# Altium schematic sheet 0262_GPU VCCGT IMVP8 VR.SchDoc
size 848 x 558 mm
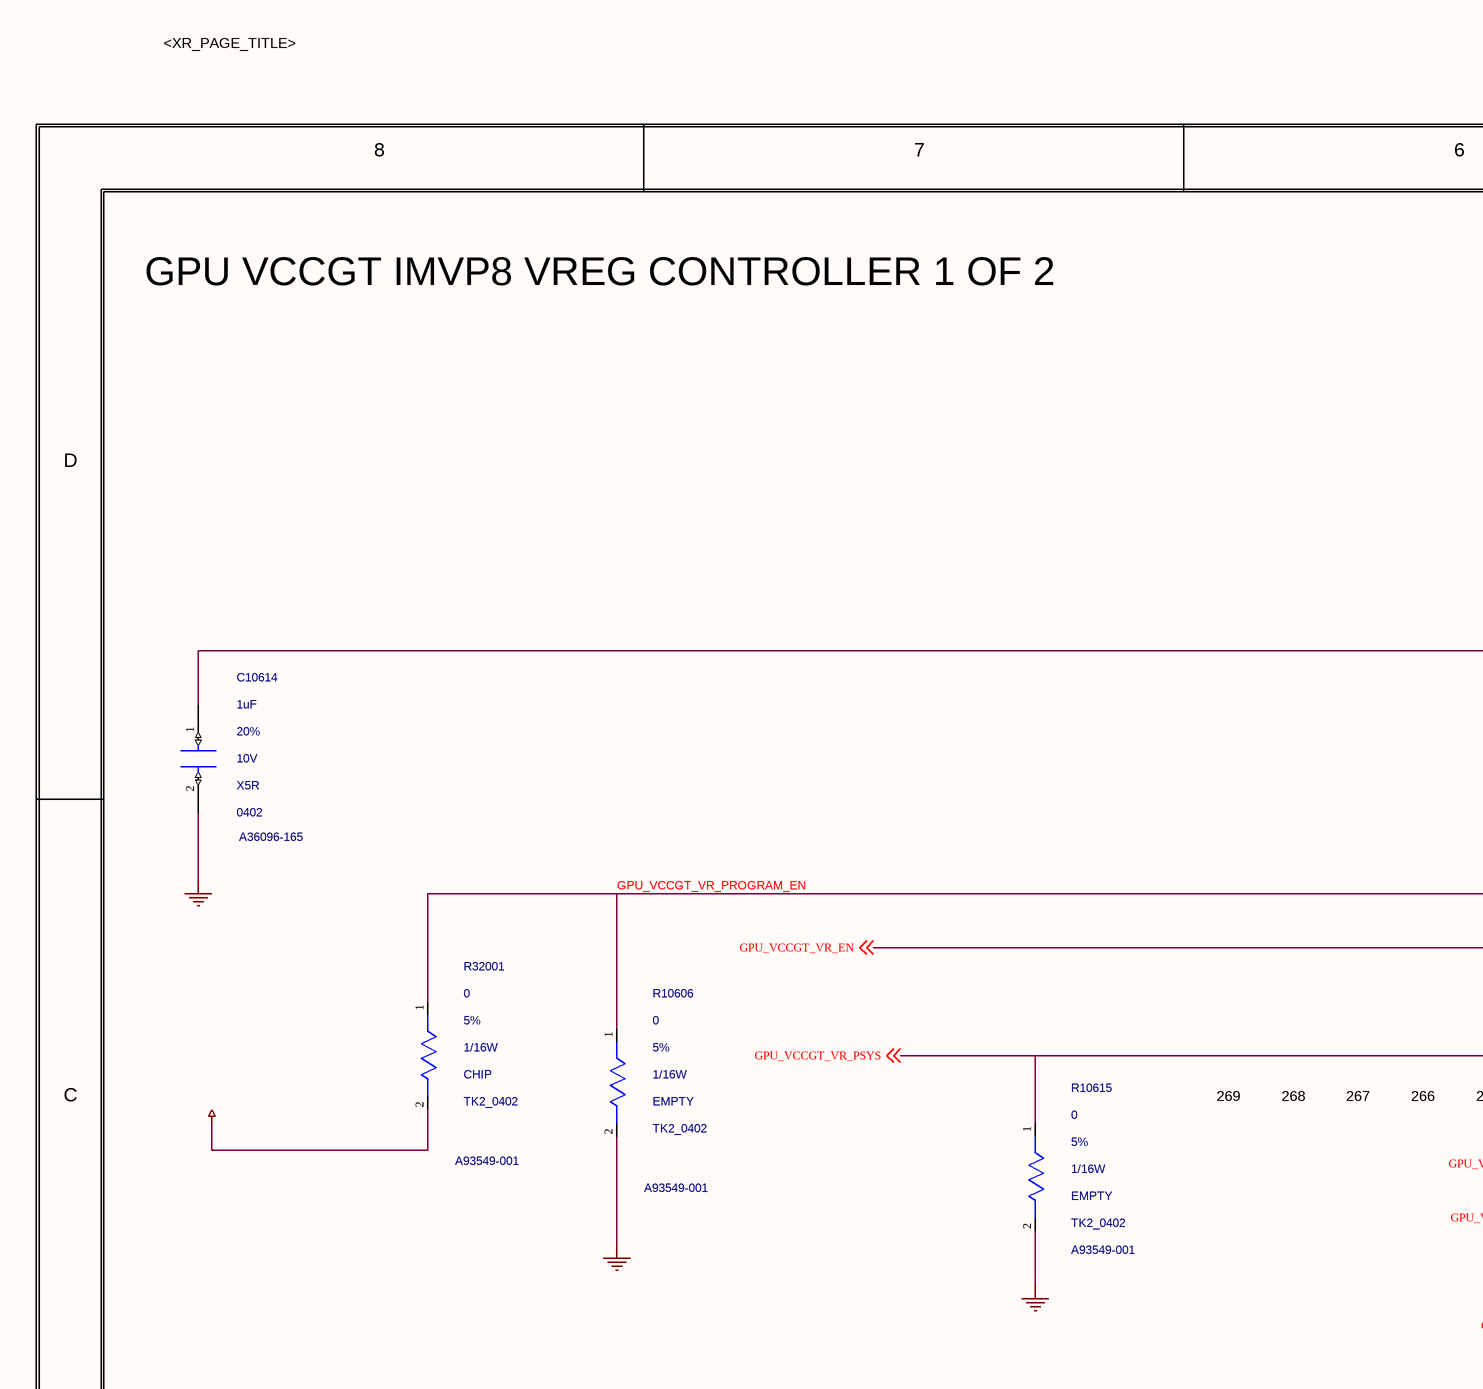
[diagram p0: 0262_GPU VCCGT IMVP8 VR.SchDoc, top left]
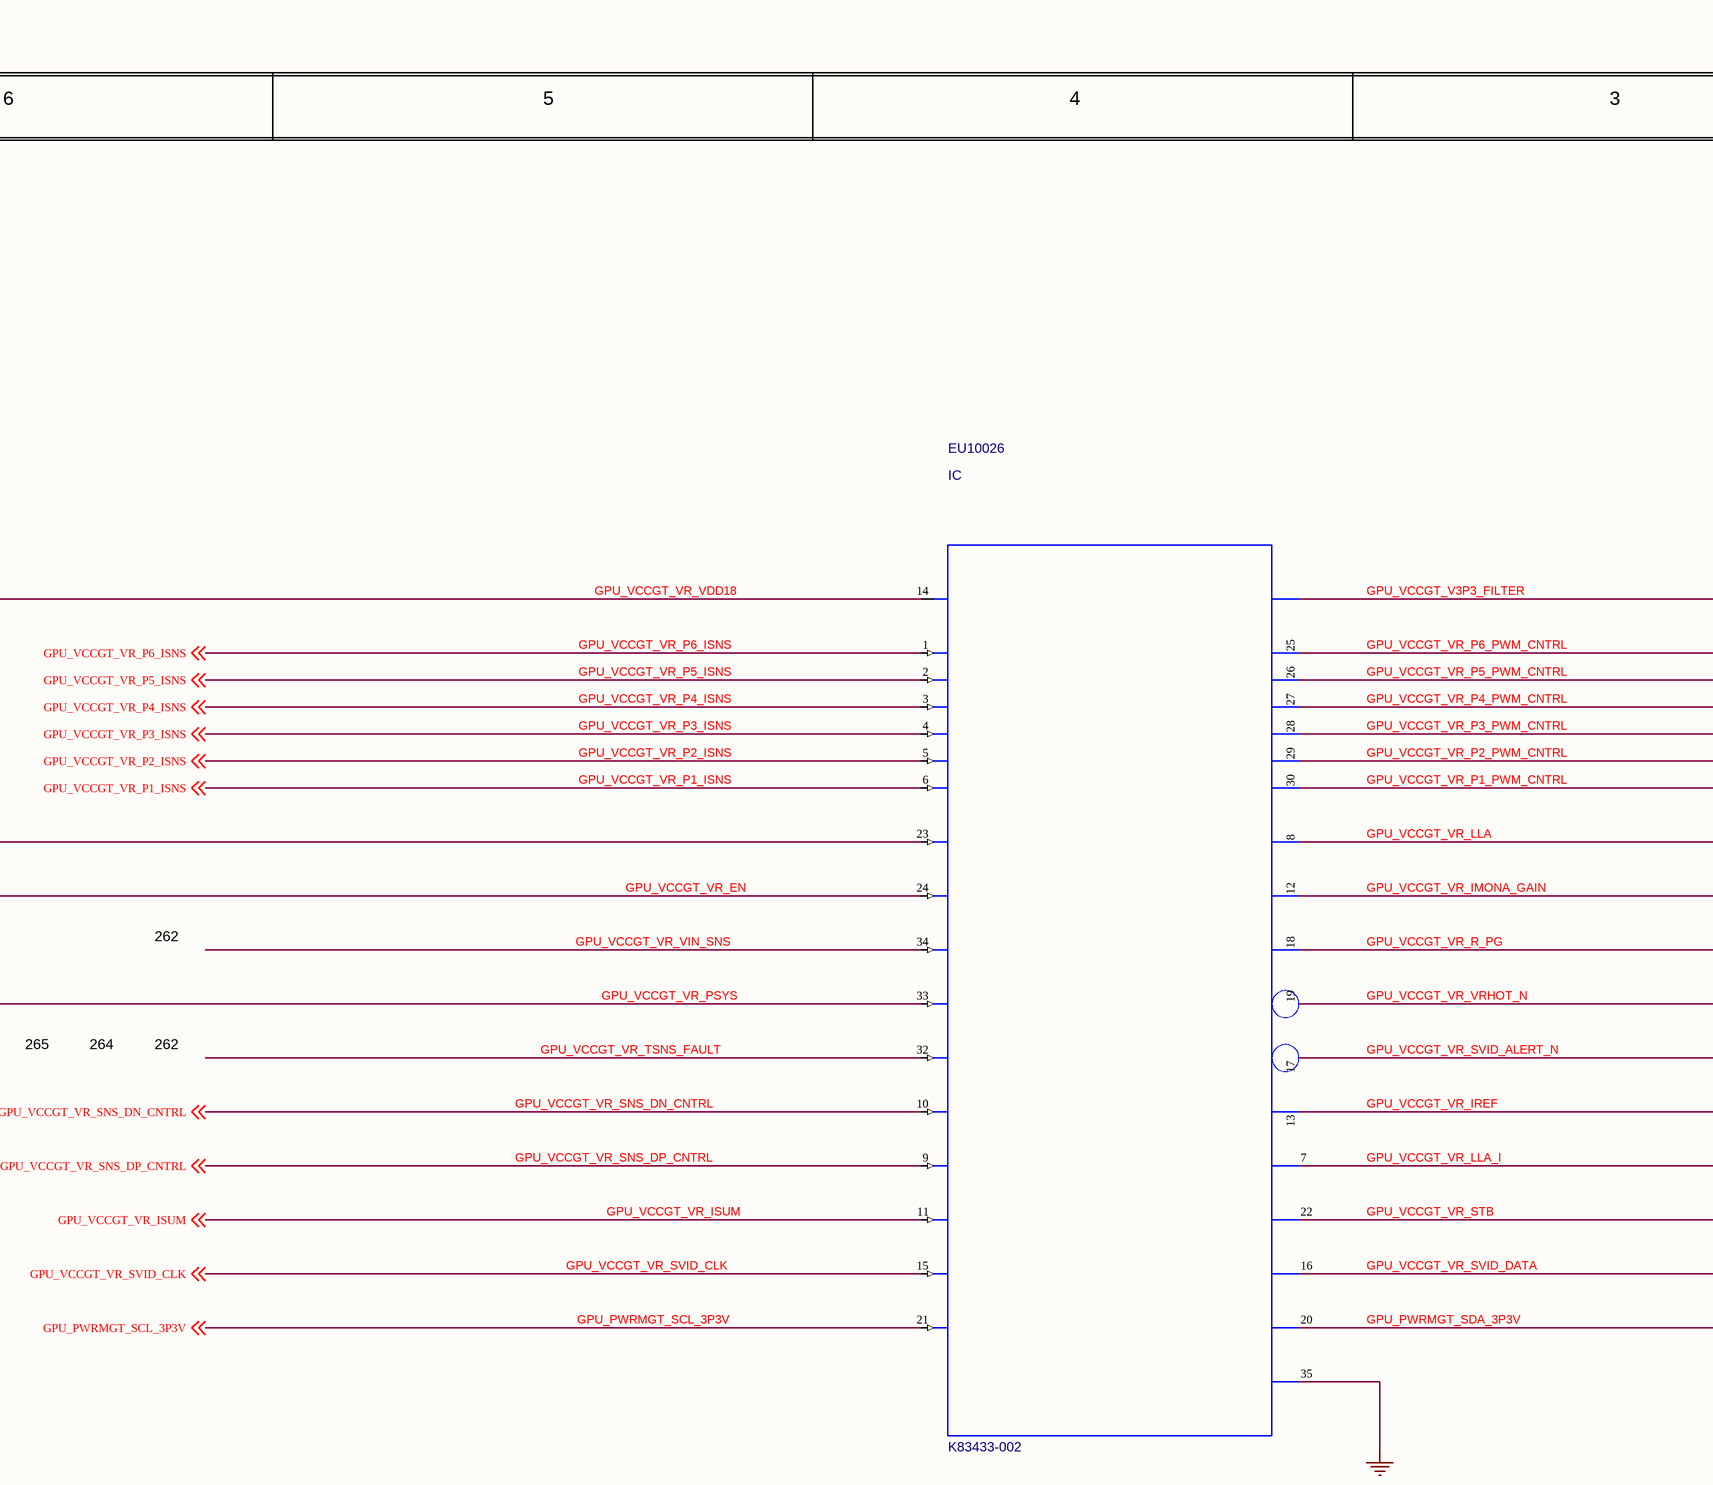
[diagram p1: 0262_GPU VCCGT IMVP8 VR.SchDoc, top middle]
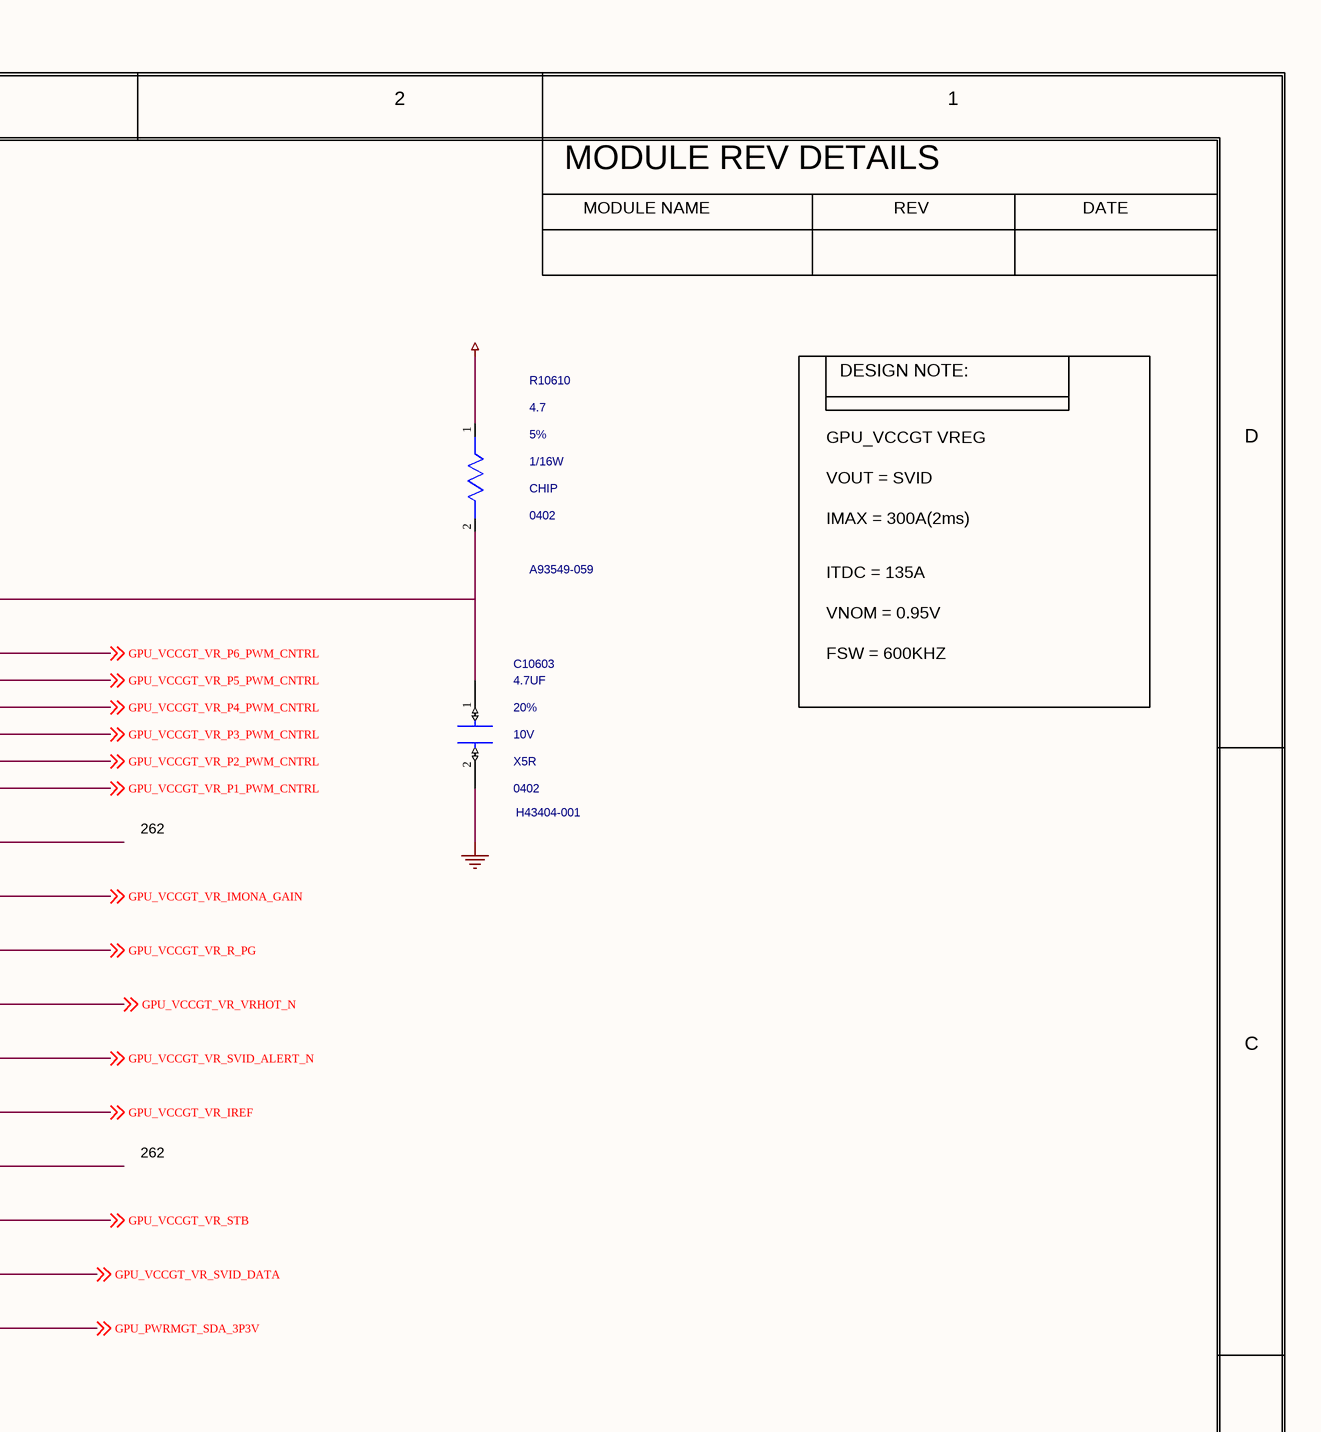
[diagram p2: 0262_GPU VCCGT IMVP8 VR.SchDoc, top right]
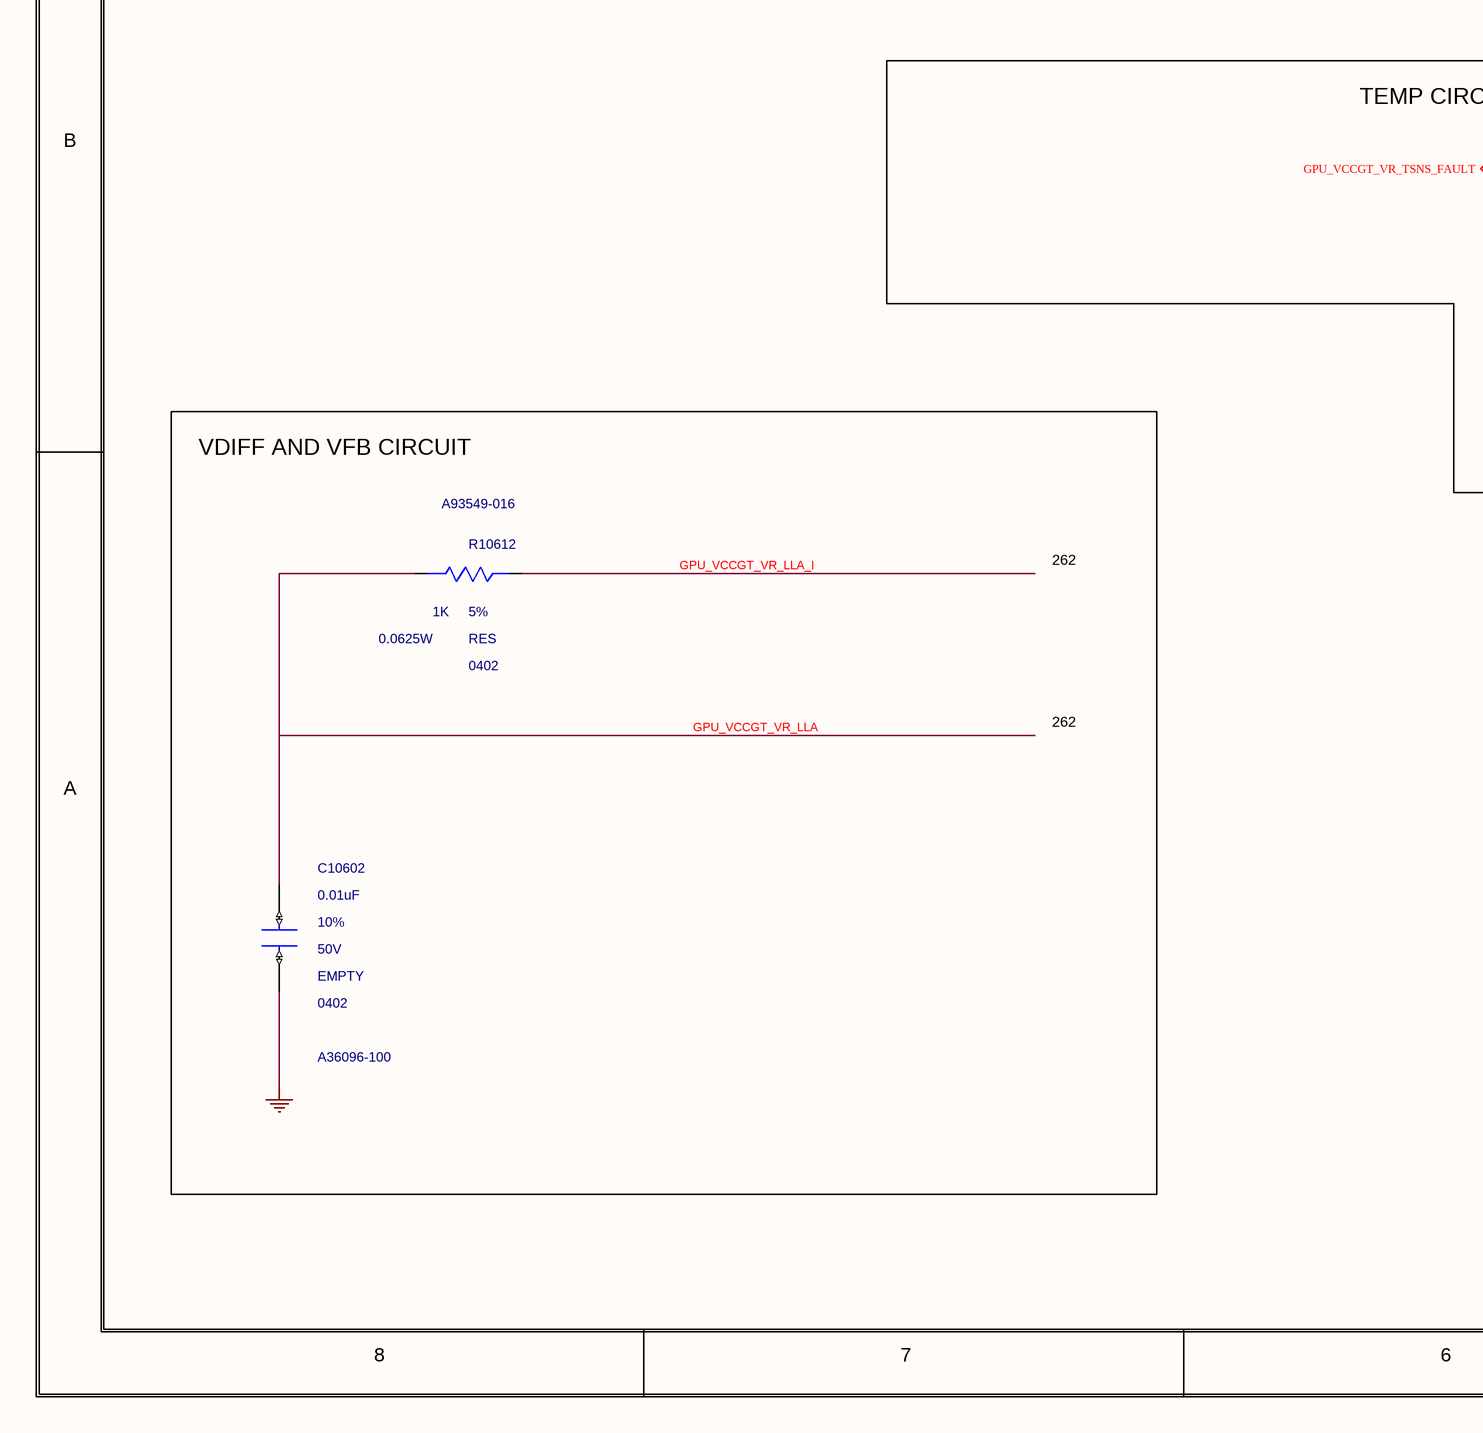
[diagram p3: 0262_GPU VCCGT IMVP8 VR.SchDoc, bottom left]
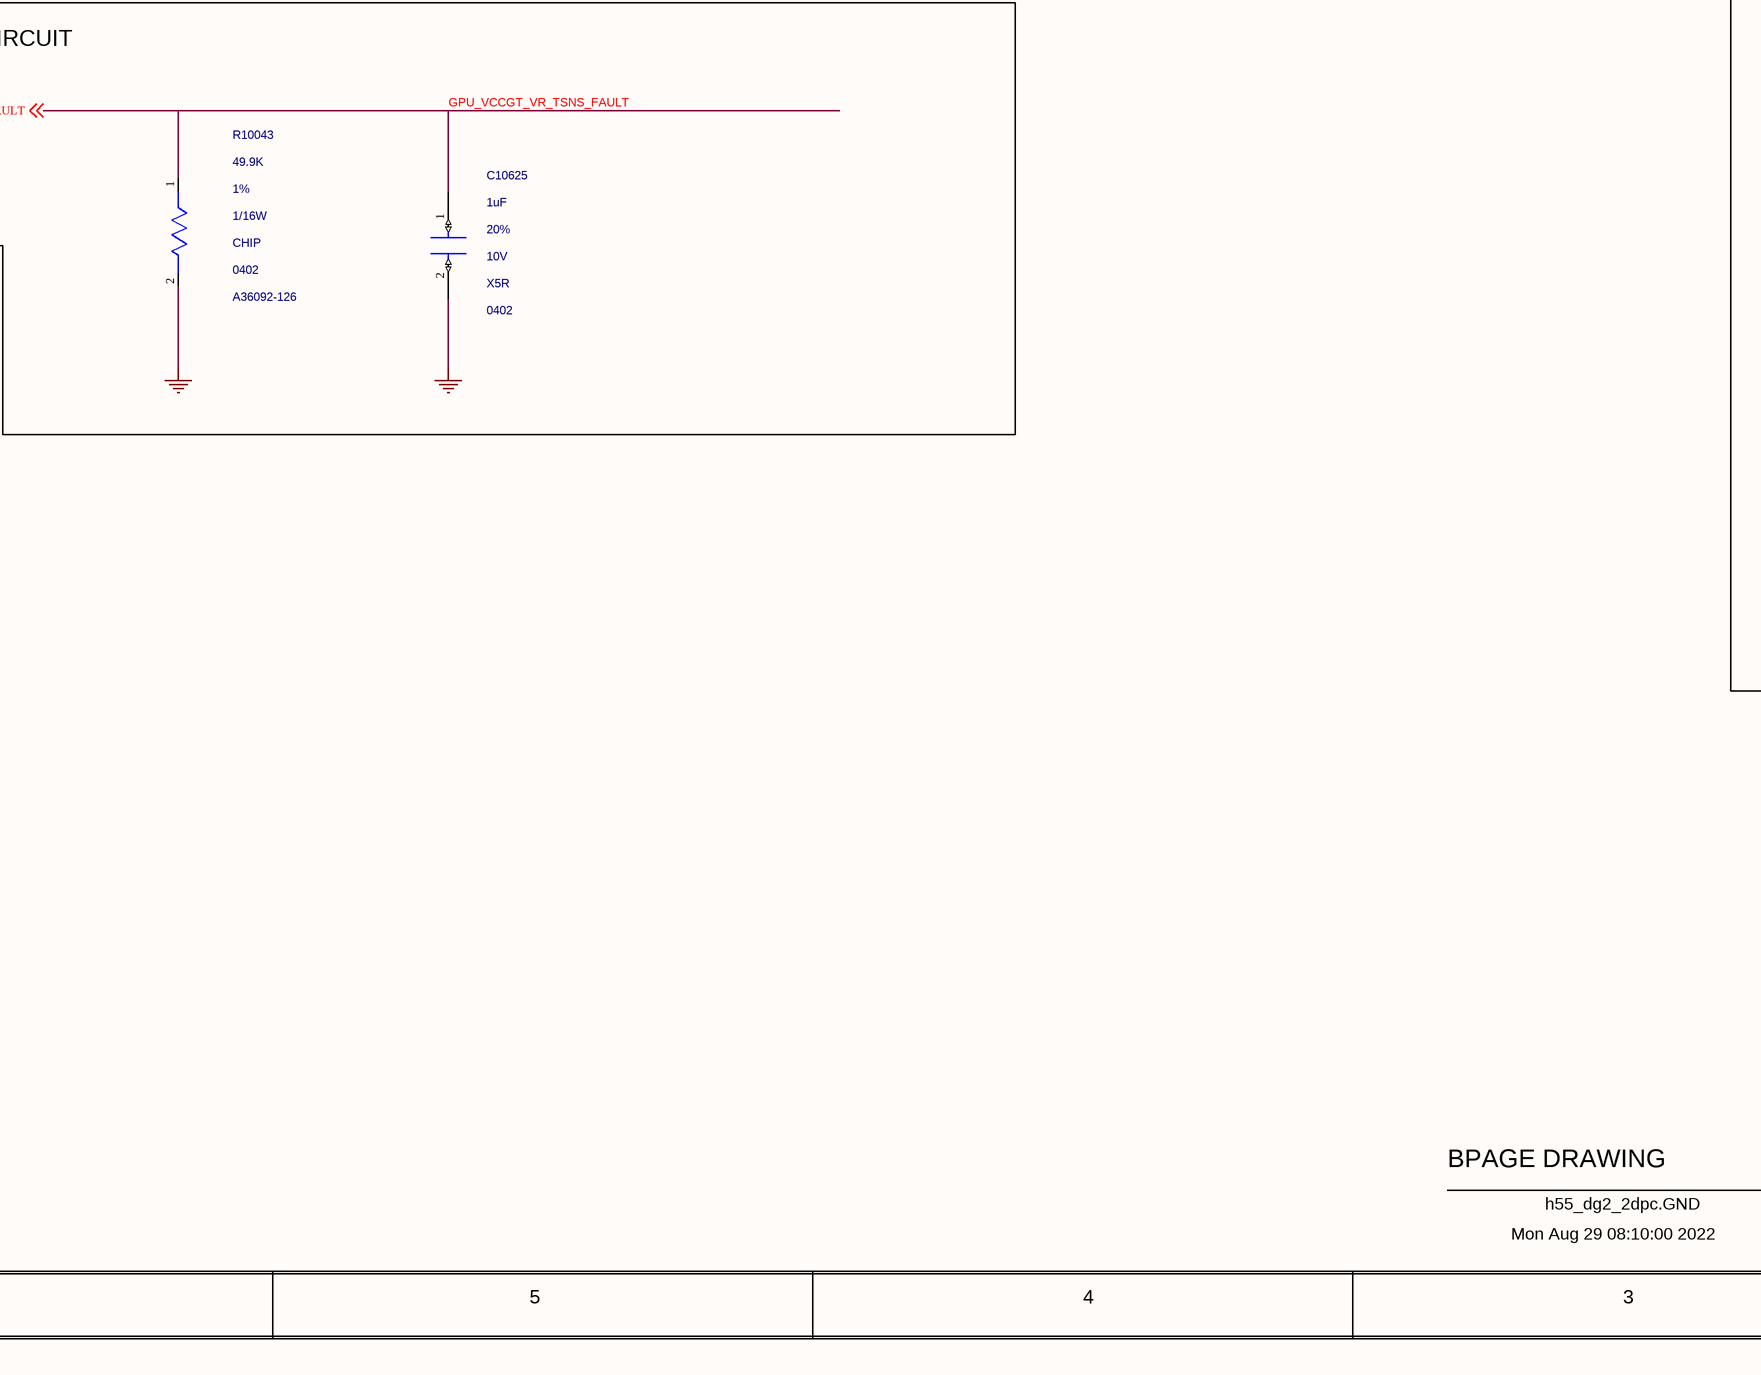
[diagram p4: 0262_GPU VCCGT IMVP8 VR.SchDoc, bottom middle]
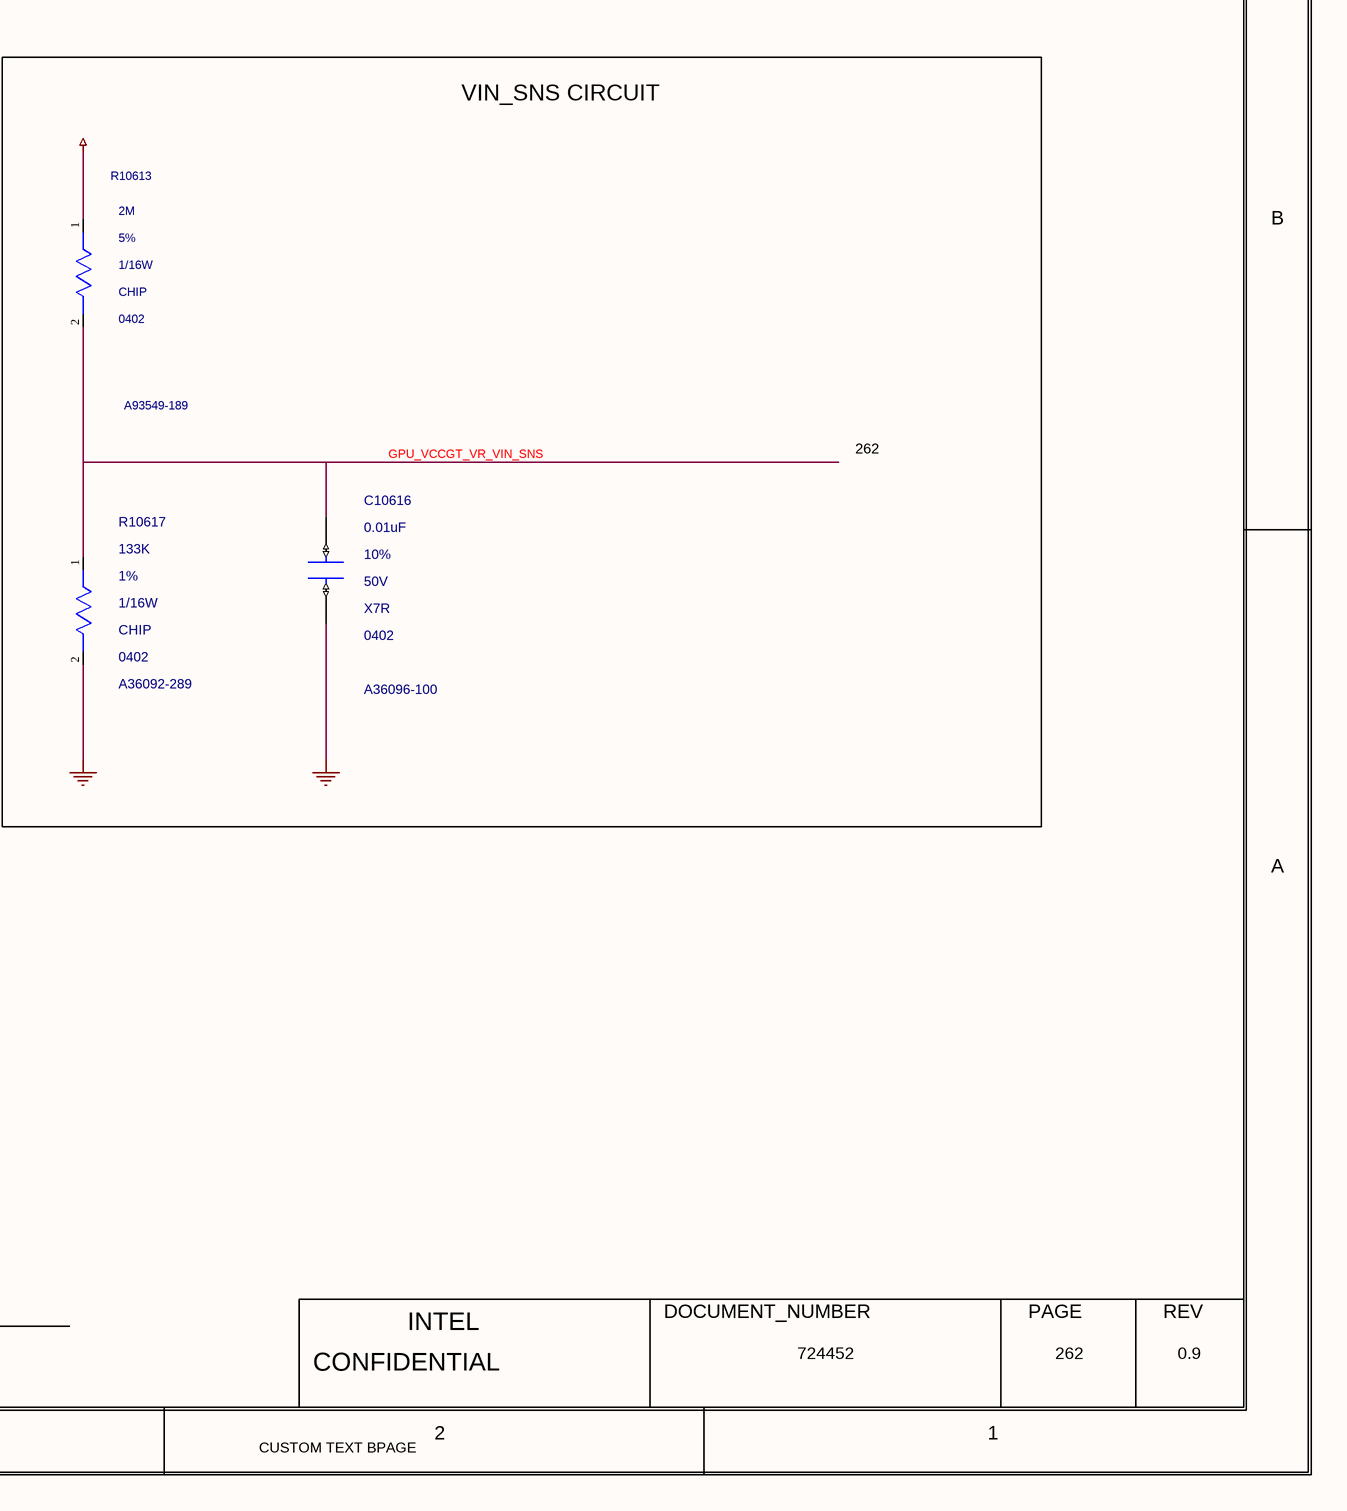
[diagram p5: 0262_GPU VCCGT IMVP8 VR.SchDoc, bottom right]

## Parts
C10602  0.01uF  MATERIAL: EMPTY  PACK_TYPE: 0402  PART_NUMBER: A36096-100  TOLERANCE: 10%  VOLTAGE: 50V  [CTK2_SM0402_1050X550_MA]
C10603  4.7UF  MATERIAL: X5R  PACK_TYPE: 0402  PART_NUMBER: H43404-001  TOLERANCE: 20%  VOLTAGE: 10V  [SMC1005MB]
C10614  1uF  MATERIAL: X5R  PACK_TYPE: 0402  PART_NUMBER: A36096-165  TOLERANCE: 20%  VOLTAGE: 10V  [SMC0402MA]
C10616  0.01uF  MATERIAL: X7R  PACK_TYPE: 0402  PART_NUMBER: A36096-100  TOLERANCE: 10%  VOLTAGE: 50V  [CTK2_SM0402_1050X550_MA]
C10625  1uF  MATERIAL: X5R  PACK_TYPE: 0402  TOLERANCE: 20%  VOLTAGE: 10V  [SMC0402MA]
EU10026  MATERIAL: IC  PART_NUMBER: K83433-002  [CTK2_LCC34_4100X5100_400_DF2600X3600_MA]  (hidden comment: C_MP2950)
R10043  49.9K  MATERIAL: CHIP  PACK_TYPE: 0402  PART_NUMBER: A36092-126  TOLERANCE: 1%  WATTAGE: 1/16W  [SMR0402IA]
R10606  0  MATERIAL: EMPTY  PACK_TYPE: TK2_0402  PART_NUMBER: A93549-001  TOLERANCE: 5%  WATTAGE: 1/16W  [SMR1005MB]
R10610  4.7  MATERIAL: CHIP  PACK_TYPE: 0402  PART_NUMBER: A93549-059  TOLERANCE: 5%  WATTAGE: 1/16W  [SMR0402IA]
R10612  1K  MATERIAL: RES  PACK_TYPE: 0402  PART_NUMBER: A93549-016  TOLERANCE: 5%  WATTAGE: 0.0625W  [CTK2_SM0402_1050X550_MA]
R10613  2M  MATERIAL: CHIP  PACK_TYPE: 0402  PART_NUMBER: A93549-189  TOLERANCE: 5%  WATTAGE: 1/16W  [SMR0402IA]
R10615  0  MATERIAL: EMPTY  PACK_TYPE: TK2_0402  PART_NUMBER: A93549-001  TOLERANCE: 5%  WATTAGE: 1/16W  [SMR1005MB]
R10617  133K  MATERIAL: CHIP  PACK_TYPE: 0402  PART_NUMBER: A36092-289  TOLERANCE: 1%  WATTAGE: 1/16W  [SMR0402IA]
R32001  0  MATERIAL: CHIP  PACK_TYPE: TK2_0402  PART_NUMBER: A93549-001  TOLERANCE: 5%  WATTAGE: 1/16W  [SMR1005MB]

## Blocks framed on the sheet
VIN_SNS CIRCUIT: C10616 R10613 R10617
TEMP CIRCUIT: C10625 R10043
VDIFF AND VFB CIRCUIT: C10602 R10612

## Nets
+V3P3S_GPU: R10610.1(A) R32001.2(B)
+VBATA_VCCGT_GPU: R10613.1(A)
GND: C10602.2(B) C10603.2(B) C10614.2(B) C10616.2(B) C10625.2(B) EU10026.35(AGND_TPD) R10043.2(B) R10606.2(B) R10615.2(B) R10617.2(B)
VDD33: EU10026.31(VDD33)
GPU_PWRMGT_SCL_3P3V: EU10026.21(SCL_P) ; off-sheet GPU_PWRMGT_SCL_3P3V
GPU_PWRMGT_SDA_3P3V: EU10026.20(SDA_P) ; off-sheet GPU_PWRMGT_SDA_3P3V
GPU_VCCGT_V3P3_FILTER: C10603.1(A) R10610.2(B)
GPU_VCCGT_VR_EN: EU10026.24(EN) ; off-sheet GPU_VCCGT_VR_EN
GPU_VCCGT_VR_IMONA_GAIN: EU10026.12(IMON) ; off-sheet GPU_VCCGT_VR_IMONA_GAIN
GPU_VCCGT_VR_IREF: EU10026.13(IREF) ; off-sheet GPU_VCCGT_VR_IREF
GPU_VCCGT_VR_ISUM: EU10026.11(CSSUM) ; off-sheet GPU_VCCGT_VR_ISUM
GPU_VCCGT_VR_LLA: C10602.1(A) EU10026.8(VFB) R10612.1(A)
GPU_VCCGT_VR_LLA_I: EU10026.7(VDIFF) R10612.2(B)
GPU_VCCGT_VR_P1_ISNS: EU10026.6(CS1) ; off-sheet GPU_VCCGT_VR_P1_ISNS
GPU_VCCGT_VR_P1_PWM_CNTRL: EU10026.30(PWM1) ; off-sheet GPU_VCCGT_VR_P1_PWM_CNTRL
GPU_VCCGT_VR_P2_ISNS: EU10026.5(CS2) ; off-sheet GPU_VCCGT_VR_P2_ISNS
GPU_VCCGT_VR_P2_PWM_CNTRL: EU10026.29(PWM2) ; off-sheet GPU_VCCGT_VR_P2_PWM_CNTRL
GPU_VCCGT_VR_P3_ISNS: EU10026.4(CS3) ; off-sheet GPU_VCCGT_VR_P3_ISNS
GPU_VCCGT_VR_P3_PWM_CNTRL: EU10026.28(PWM3) ; off-sheet GPU_VCCGT_VR_P3_PWM_CNTRL
GPU_VCCGT_VR_P4_ISNS: EU10026.3(CS4) ; off-sheet GPU_VCCGT_VR_P4_ISNS
GPU_VCCGT_VR_P4_PWM_CNTRL: EU10026.27(PWM4) ; off-sheet GPU_VCCGT_VR_P4_PWM_CNTRL
GPU_VCCGT_VR_P5_ISNS: EU10026.2(CS5) ; off-sheet GPU_VCCGT_VR_P5_ISNS
GPU_VCCGT_VR_P5_PWM_CNTRL: EU10026.26(PWM5) ; off-sheet GPU_VCCGT_VR_P5_PWM_CNTRL
GPU_VCCGT_VR_P6_ISNS: EU10026.1(CS6) ; off-sheet GPU_VCCGT_VR_P6_ISNS
GPU_VCCGT_VR_P6_PWM_CNTRL: EU10026.25(PWM6) ; off-sheet GPU_VCCGT_VR_P6_PWM_CNTRL
GPU_VCCGT_VR_PROGRAM_EN: EU10026.23(PE) R10606.1(A) R32001.1(A)
GPU_VCCGT_VR_PSYS: EU10026.33(PSYS) R10615.1(A) ; off-sheet GPU_VCCGT_VR_PSYS
GPU_VCCGT_VR_R_PG: EU10026.18(VRRDY) ; off-sheet GPU_VCCGT_VR_R_PG
GPU_VCCGT_VR_SNS_DN_CNTRL: EU10026.10(VORTN) ; off-sheet GPU_VCCGT_VR_SNS_DN_CNTRL
GPU_VCCGT_VR_SNS_DP_CNTRL: EU10026.9(VOSEN) ; off-sheet GPU_VCCGT_VR_SNS_DP_CNTRL
GPU_VCCGT_VR_STB: EU10026.22(STB) ; off-sheet GPU_VCCGT_VR_STB
GPU_VCCGT_VR_SVID_ALERT_N: EU10026.17(ALERT_N) ; off-sheet GPU_VCCGT_VR_SVID_ALERT_N
GPU_VCCGT_VR_SVID_CLK: EU10026.15(SCLK) ; off-sheet GPU_VCCGT_VR_SVID_CLK
GPU_VCCGT_VR_SVID_DATA: EU10026.16(SDIO) ; off-sheet GPU_VCCGT_VR_SVID_DATA
GPU_VCCGT_VR_TSNS_FAULT: C10625.1(A) EU10026.32(TEMP) R10043.1(A) ; off-sheet GPU_VCCGT_VR_TSNS_FAULT
GPU_VCCGT_VR_VDD18: C10614.1(A) EU10026.14(VDD18)
GPU_VCCGT_VR_VIN_SNS: C10616.1(A) EU10026.34(VIN_SEN) R10613.2(B) R10617.1(A)
GPU_VCCGT_VR_VRHOT_N: EU10026.19(VRHOT_N) ; off-sheet GPU_VCCGT_VR_VRHOT_N

## Notes on the sheet
- <XR_PAGE_TITLE>
- 8
- 7
- 6
- 5
- 4
- 3
- 2
- 1
- MODULE REV DETAILS
- GPU VCCGT IMVP8 VREG CONTROLLER 1 OF 2
- MODULE NAME
- REV
- DATE
- DESIGN NOTE:
- D
- GPU_VCCGT VREG
- IMAX = 300A(2ms)
- VOUT = SVID
- ITDC = 135A
- FSW = 600KHZ
- VNOM = 0.95V
- 262
- C
- 269
- 268
- 267
- 266
- 265
- 264
- B
- A
- BPAGE DRAWING
- INTEL
- DOCUMENT_NUMBER
- PAGE
- Mon Aug 29 08:10:00 2022
- h55_dg2_2dpc.GND
- CONFIDENTIAL
- 724452
- 0.9
- CUSTOM TEXT BPAGE

## Library data of the parts
C10602 = C_CAP: CDS_PHYS_PART_NAME: C_CAP_0402-A36096-100,EMPTY,0.01UF,50V,10%,TK2,GENERIC; CDS_LMAN_SYM_OUTLINE: -50,50,50,-50; FP_TECH: TK2; IP: GENERIC; ROOM: NONE; OriginalSymbolOrigin: (-50,25); XY: (800,475); VER: 1; ROT: 0; PHYS_PAGE: 262; LOCATION: C10602; DRAWING: @RVP1_ADL_SB_ADP_S_DDR5_SODIMM_2DPC_LIB.H55_DG2_2DPC(SCH_1):PAGE435; CDS_LIB: c_discrete; VARIANT: ?; PCB Footprint: CTK2_SM0402_1050X550_MA; SEC_TYPE: 0402; CHIPS_PART_NAME: C_CAP; CDS_PART_NAME: C_CAP_0402-A36096-100,EMPTY,0.01UF,50V,10%,TK2,GENERIC; CDS_LOCATION: C10602
C10603 = CAP: CDS_PHYS_PART_NAME: CAP_0402-H43404-001,X5R,4.7UF,10V,20%,LPDB,GENERIC; OriginalSymbolOrigin: (-50,25); XY: (7100,3650); VER: 1; ROT: 0; PHYS_PAGE: 262; LOCATION: C10603; DRAWING: @RVP1_ADL_SB_ADP_S_DDR5_SODIMM_2DPC_LIB.H55_DG2_2DPC(SCH_1):PAGE435; CDS_LIB: discrete; PCB Footprint: SMC1005MB; CHIPS_PART_NAME: CAP; CDS_PART_NAME: CAP_0402-H43404-001,X5R,4.7UF,10V,20%,LPDB,GENERIC; CDS_LOCATION: C10603
C10614 = CAP: CDS_PHYS_PART_NAME: CAP_0402-A36096-165,X5R,1UF,10V,20%,LPDB,GENERIC; OriginalSymbolOrigin: (-50,25); XY: (650,3700); VER: 1; SUB_ROOM: GPU_VCCIN; ROT: 0; PHYS_PAGE: 262; LOCATION: C10614; DRAWING: @RVP1_ADL_SB_ADP_S_DDR5_SODIMM_2DPC_LIB.H55_DG2_2DPC(SCH_1):PAGE435; CDS_LIB: discrete; PCB Footprint: SMC0402MA; CHIPS_PART_NAME: CAP; CDS_PART_NAME: CAP_0402-A36096-165,X5R,1UF,10V,20%,LPDB,GENERIC; CDS_LOCATION: C10614
C10616 = C_CAP: CDS_PHYS_PART_NAME: C_CAP_0402-A36096-100,X7R,0.01UF,50V,10%,TK2,GENERIC; CDS_LMAN_SYM_OUTLINE: -50,50,50,-50; FP_TECH: TK2; IP: GENERIC; ROOM: NONE; OriginalSymbolOrigin: (-50,25); XY: (6775,1300); VER: 1; ROT: 0; PHYS_PAGE: 262; LOCATION: C10616; DRAWING: @RVP1_ADL_SB_ADP_S_DDR5_SODIMM_2DPC_LIB.H55_DG2_2DPC(SCH_1):PAGE435; CDS_LIB: c_discrete; VARIANT: ?; PCB Footprint: CTK2_SM0402_1050X550_MA; CHIPS_PART_NAME: C_CAP; CDS_PART_NAME: C_CAP_0402-A36096-100,X7R,0.01UF,50V,10%,TK2,GENERIC; CDS_LOCATION: C10616
C10625 = CAP: PART_NUMBER: A36096-165; CDS_PHYS_PART_NAME: CAP_0402-A36096-165,X5R,1UF,10V,20%,LPDB,GENERIC; OriginalSymbolOrigin: (-50,25); XY: (3800,1650); VER: 1; SUB_ROOM: GPU_VCCIN; ROT: 0; PHYS_PAGE: 262; LOCATION: C10625; DRAWING: @RVP1_ADL_SB_ADP_S_DDR5_SODIMM_2DPC_LIB.H55_DG2_2DPC(SCH_1):PAGE435; CDS_LIB: discrete; PCB Footprint: SMC0402MA; CHIPS_PART_NAME: CAP; CDS_PART_NAME: CAP_0402-A36096-165,X5R,1UF,10V,20%,LPDB,GENERIC; CDS_LOCATION: C10625
EU10026 = C_MP2950: CDS_PHYS_PART_NAME: C_MP2950_LCC-K83433-002,IC,MP2950GVT-0011,TK2,GENERIC; CDS_LMAN_SYM_OUTLINE: -300,800,300,-850; FP_TECH: TK2; IP: GENERIC; PACK_TYPE: LCC; ROOM: NONE; OriginalSymbolOrigin: (-325,800); XY: (5025,3200); VER: 1; ROT: 0; PHYS_PAGE: 262; LOCATION: EU10026; DRAWING: @RVP1_ADL_SB_ADP_S_DDR5_SODIMM_2DPC_LIB.H55_DG2_2DPC(SCH_1):PAGE435; CDS_LIB: local; VARIANT: ?; PCB Footprint: CTK2_LCC34_4100X5100_400_DF2600X3600_MA; SEC_TYPE: LCC; CHIPS_PART_NAME: C_MP2950; CDS_PART_NAME: C_MP2950_LCC-K83433-002,IC,MP2950GVT-0011,TK2,GENERIC; CDS_LOCATION: EU10026
R10043 = RES: CDS_PHYS_PART_NAME: RES_0402-A36092-126,CHIP,49.9K,1%,1/16W,LPDB,GENERIC; OriginalSymbolOrigin: (-25,75); XY: (3300,1675); VER: 2; ROT: 0; PHYS_PAGE: 262; LOCATION: R10043; IP: GENERIC; FP_TECH: LPDB; DRAWING: @RVP1_ADL_SB_ADP_S_DDR5_SODIMM_2DPC_LIB.H55_DG2_2DPC(SCH_1):PAGE435; CDS_LIB: discrete; PCB Footprint: SMR0402IA; CHIPS_PART_NAME: RES; CDS_PART_NAME: RES_0402-A36092-126,CHIP,49.9K,1%,1/16W,LPDB,GENERIC; CDS_LOCATION: R10043
R10606 = RES: CDS_PHYS_PART_NAME: RES_TK2_0402-A93549-001,EMPTY,0,5%,1/16W,TK2,GENERIC; OriginalSymbolOrigin: (-25,75); XY: (1425,3100); VER: 2; SUB_ROOM: GPU_VCCIN; PHYS_PAGE: 262; LOCATION: R10606; IP: GENERIC; FP_TECH: TK2; DRAWING: @RVP1_ADL_SB_ADP_S_DDR5_SODIMM_2DPC_LIB.H55_DG2_2DPC(SCH_1):PAGE435; CDS_LIB: discrete; PCB Footprint: SMR1005MB; ROT: 0; CHIPS_PART_NAME: RES; CDS_PART_NAME: RES_TK2_0402-A93549-001,EMPTY,0,5%,1/16W,TK2,GENERIC; CDS_LOCATION: R10606
R10610 = RES: CDS_PHYS_PART_NAME: RES_0402-A93549-059,CHIP,4.7,5%,1/16W,LPDB,GENERIC; OriginalSymbolOrigin: (-25,75); XY: (7100,4125); VER: 2; ROT: 0; PHYS_PAGE: 262; LOCATION: R10610; IP: GENERIC; FP_TECH: LPDB; DRAWING: @RVP1_ADL_SB_ADP_S_DDR5_SODIMM_2DPC_LIB.H55_DG2_2DPC(SCH_1):PAGE435; CDS_LIB: discrete; PCB Footprint: SMR0402IA; CHIPS_PART_NAME: RES; CDS_PART_NAME: RES_0402-A93549-059,CHIP,4.7,5%,1/16W,LPDB,GENERIC; CDS_LOCATION: R10610
R10612 = C_RES#1: CHIPS_PART_NAME: C_RES; CDS_PHYS_PART_NAME: C_RES_0402-A93549-016,RES,1K,5%,0.0625W,TK2,GENERIC; CDS_LMAN_SYM_OUTLINE: -50,50,50,-50; FP_TECH: TK2; IP: GENERIC; ROOM: NONE; OriginalSymbolOrigin: (-75,25); XY: (1150,1150); VER: 1; ROT: 0; PHYS_PAGE: 262; LOCATION: R10612; DRAWING: @RVP1_ADL_SB_ADP_S_DDR5_SODIMM_2DPC_LIB.H55_DG2_2DPC(SCH_1):PAGE435; CDS_LIB: c_discrete; VARIANT: ?; PCB Footprint: CTK2_SM0402_1050X550_MA; CDS_PART_NAME: C_RES_0402-A93549-016,RES,1K,5%,0.0625W,TK2,GENERIC; CDS_LOCATION: R10612
R10613 = RES: CDS_PHYS_PART_NAME: RES_0402-A93549-189,CHIP,2M,5%,1/16W,LPDB,GENERIC; OriginalSymbolOrigin: (-25,75); XY: (6325,1850); VER: 2; ROT: 0; PHYS_PAGE: 262; LOCATION: R10613; IP: GENERIC; FP_TECH: LPDB; DRAWING: @RVP1_ADL_SB_ADP_S_DDR5_SODIMM_2DPC_LIB.H55_DG2_2DPC(SCH_1):PAGE435; CDS_LIB: discrete; PCB Footprint: SMR0402IA; CHIPS_PART_NAME: RES; CDS_PART_NAME: RES_0402-A93549-189,CHIP,2M,5%,1/16W,LPDB,GENERIC; CDS_LOCATION: R10613
R10615 = RES: CDS_PHYS_PART_NAME: RES_TK2_0402-A93549-001,EMPTY,0,5%,1/16W,TK2,GENERIC; OriginalSymbolOrigin: (-25,75); XY: (2200,2925); VER: 2; PHYS_PAGE: 262; LOCATION: R10615; IP: GENERIC; FP_TECH: TK2; DRAWING: @RVP1_ADL_SB_ADP_S_DDR5_SODIMM_2DPC_LIB.H55_DG2_2DPC(SCH_1):PAGE435; CDS_LIB: discrete; PCB Footprint: SMR1005MB; ROT: 0; CHIPS_PART_NAME: RES; CDS_PART_NAME: RES_TK2_0402-A93549-001,EMPTY,0,5%,1/16W,TK2,GENERIC; CDS_LOCATION: R10615
R10617 = RES: CDS_PHYS_PART_NAME: RES_0402-A36092-289,CHIP,133K,1%,1/16W,LPDB,GENERIC; OriginalSymbolOrigin: (-25,75); XY: (6325,1225); VER: 2; ROT: 0; PHYS_PAGE: 262; LOCATION: R10617; IP: GENERIC; FP_TECH: LPDB; DRAWING: @RVP1_ADL_SB_ADP_S_DDR5_SODIMM_2DPC_LIB.H55_DG2_2DPC(SCH_1):PAGE435; CDS_LIB: discrete; PCB Footprint: SMR0402IA; CHIPS_PART_NAME: RES; CDS_PART_NAME: RES_0402-A36092-289,CHIP,133K,1%,1/16W,LPDB,GENERIC; CDS_LOCATION: R10617
R32001 = RES: CDS_PHYS_PART_NAME: RES_TK2_0402-A93549-001,CHIP,0,5%,1/16W,TK2,GENERIC; OriginalSymbolOrigin: (-25,75); XY: (1075,3150); VER: 2; SUB_ROOM: GPU_VCCIN; PHYS_PAGE: 262; LOCATION: R32001; IP: GENERIC; FP_TECH: TK2; DRAWING: @RVP1_ADL_SB_ADP_S_DDR5_SODIMM_2DPC_LIB.H55_DG2_2DPC(SCH_1):PAGE435; CDS_LIB: discrete; PCB Footprint: SMR1005MB; ROT: 0; CHIPS_PART_NAME: RES; CDS_PART_NAME: RES_TK2_0402-A93549-001,CHIP,0,5%,1/16W,TK2,GENERIC; CDS_LOCATION: R32001